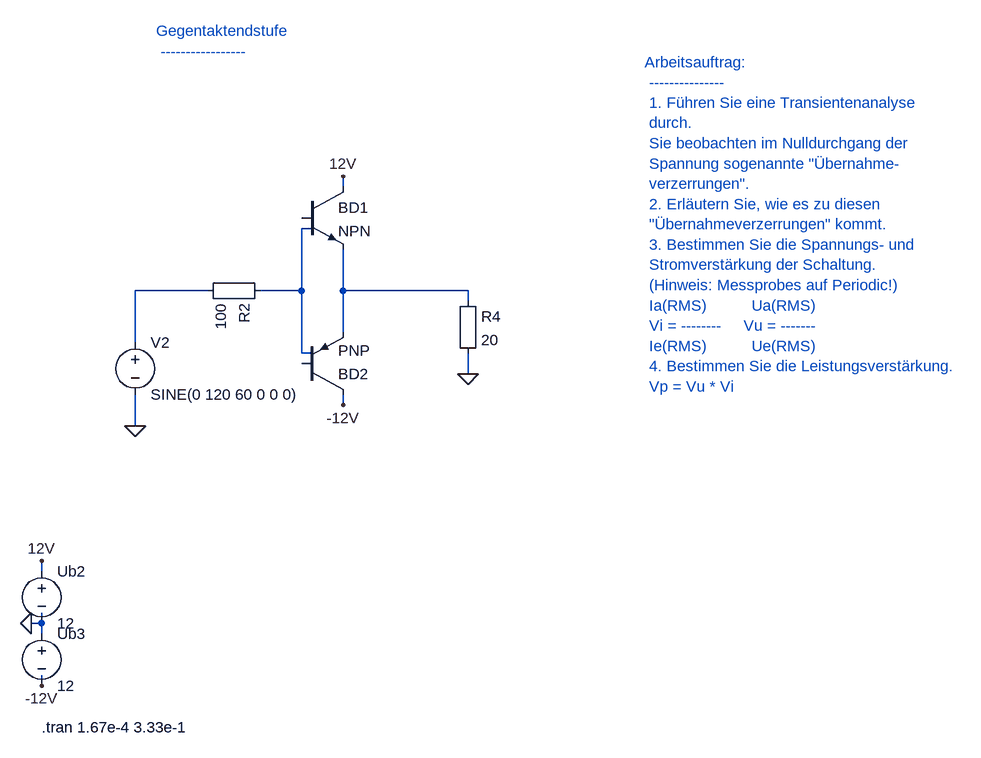
[diagram p0: schematic 9_2_3_Gegentaktendstufe.asc]
9_2_3_Gegentaktendstufe.asc, the LTspice schematic file:
Version 4
SHEET 1 880 680
WIRE 64 960 64 944
WIRE 464 336 480 336
WIRE 480 336 480 352
WIRE 528 384 528 416
WIRE 208 608 208 624
WIRE 64 1056 64 1040
WIRE 464 560 480 560
WIRE 480 560 480 544
WIRE 528 512 528 480
WIRE 48 960 64 960
WIRE 64 880 64 864
WIRE 208 656 208 624
WIRE 720 576 720 544
WIRE 208 528 208 448
WIRE 208 448 320 448
WIRE 64 976 64 960
WIRE 528 288 528 272
WIRE 400 448 464 448
WIRE 720 464 720 448
WIRE 720 448 528 448
WIRE 528 624 528 608
WIRE 528 448 528 416
WIRE 528 480 528 448
WIRE 464 448 464 352
WIRE 464 352 480 352
WIRE 480 544 464 544
WIRE 464 544 464 448
FLAG 48 960 0
FLAG 208 656 0
FLAG 720 576 0
FLAG 48 960 0
FLAG 208 656 0
FLAG 720 576 0
FLAG 64 864 12V
FLAG 528 272 12V
FLAG 64 1056 -12V
FLAG 528 624 -12V
SYMBOL voltage 64 864 R0
SYMATTR InstName Ub2
SYMATTR Value 12
SYMBOL npn 464 288 R0
SYMATTR InstName BD1
SYMATTR Value NPN
SYMBOL Misc\EuropeanResistor 416 432 R90
SYMATTR InstName R2
SYMATTR Value 100
SYMBOL voltage 208 512 R0
SYMATTR InstName V2
SYMATTR Value SINE(0 120 60 0 0 0)
SYMBOL Misc\EuropeanResistor 704 448 R0
SYMATTR InstName R4
SYMATTR Value 20
SYMBOL voltage 64 960 R0
SYMATTR InstName Ub3
SYMATTR Value 12
SYMBOL pnp 464 608 M180
SYMATTR InstName BD2
SYMATTR Value PNP
TEXT 64 1120 Left 2 !.tran 1.67e-4 3.33e-1
TEXT 240 48 Left 2 ;Gegentaktendstufe \n -----------------
TEXT 992 96 Left 2 ;Arbeitsauftrag: \n --------------- \n 1. Führen Sie eine Transientenanalyse \n durch. \n Sie beobachten im Nulldurchgang der \n Spannung sogenannte "Übernahme- \n verzerrungen". \n 2. Erläutern Sie, wie es zu diesen \n "Übernahmeverzerrungen" kommt. \n 3. Bestimmen Sie die Spannungs- und \n Stromverstärkung der Schaltung. \n (Hinweis: Messprobes auf Periodic!) \n Ia(RMS)          Ua(RMS) \n Vi = --------     Vu = ------- \n Ie(RMS)          Ue(RMS) \n 4. Bestimmen Sie die Leistungsverstärkung. \n Vp = Vu * Vi

The netlist it stands for:
* 9_2_3_Gegentaktendstufe.asc
V§Ub2 12V 0 12
Q§BD1 12V N001 N002 0 NPN
R2 N001 N003 100
V2 N003 0 SINE(0 120 60 0 0 0)
R4 N002 0 20
V§Ub3 0 -12V 12
Q§BD2 -12V N001 N002 0 PNP
.model NPN NPN
.model PNP PNP
.lib standard.bjt
.tran 1.67e-4 3.33e-1
* Gegentaktendstufe
*  -----------------
* Arbeitsauftrag:
*  ---------------
*  1. Führen Sie eine Transientenanalyse
*  durch.
*  Sie beobachten im Nulldurchgang der
*  Spannung sogenannte "Übernahme-
*  verzerrungen".
*  2. Erläutern Sie, wie es zu diesen
*  "Übernahmeverzerrungen" kommt.
*  3. Bestimmen Sie die Spannungs- und
*  Stromverstärkung der Schaltung.
*  (Hinweis: Messprobes auf Periodic!)
*  Ia(RMS)          Ua(RMS)
*  Vi = --------     Vu = -------
*  Ie(RMS)          Ue(RMS)
*  4. Bestimmen Sie die Leistungsverstärkung.
*  Vp = Vu * Vi
.backanno
.end